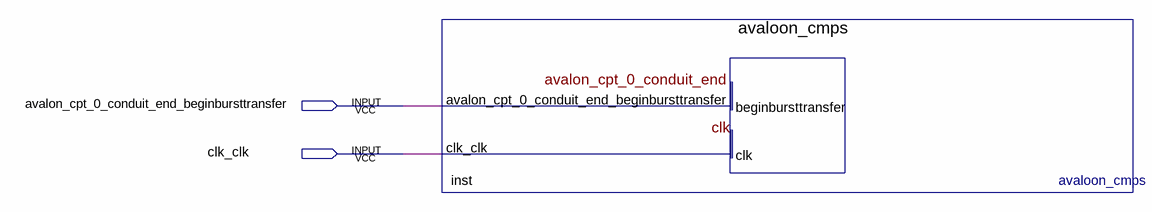
[diagram p0: schematic sheet]
// Quartus schematic schematic.bdf as structural Verilog: 1 symbols, 2 pins
module schematic (
  input  avalon_cpt_0_conduit_end_beginbursttransfer,
  input  clk_clk
);

  avaloon_cmps inst (
    .avalon_cpt_0_conduit_end_beginbursttransfer(avalon_cpt_0_conduit_end_beginbursttransfer),
    .clk_clk(clk_clk));
endmodule
